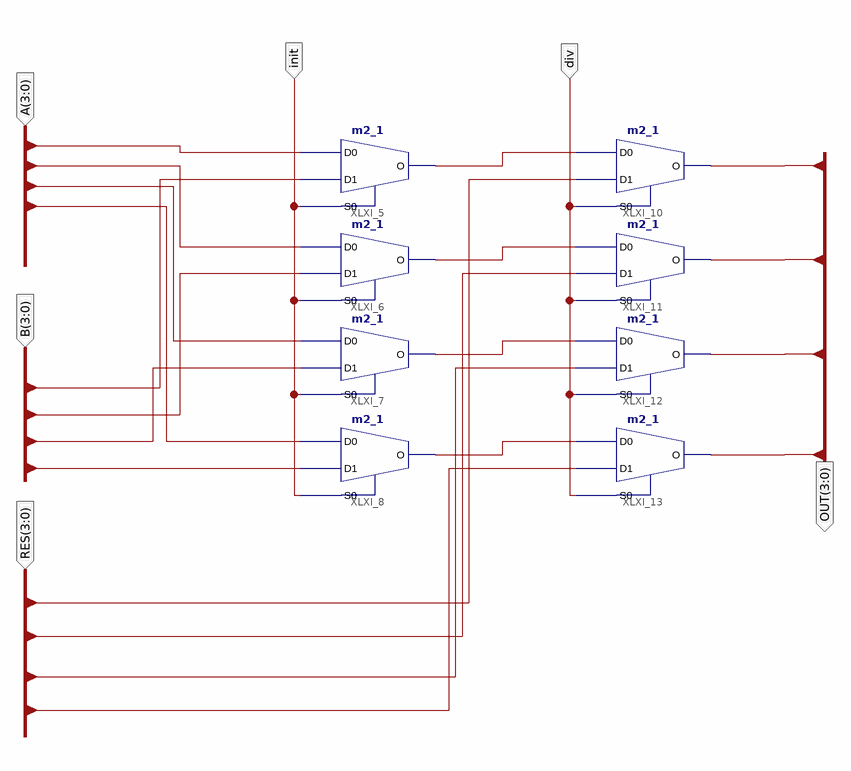
[diagram p0: schematic sheet 1]
// Xilinx ISE schematic mux.sch (spartan3) as structural Verilog: 8 symbols, 6 ports
module mux (
  input  [3:0] B,
  input  [3:0] RES,
  input  [3:0] A,
  input  init,
  input  div,
  output [3:0] OUT
);

  wire XLXN_1, XLXN_2, XLXN_3, XLXN_4, XLXN_13, XLXN_14, XLXN_15, XLXN_16, XLXN_17, XLXN_19, XLXN_20,
       XLXN_21, XLXN_22, XLXN_23, XLXN_24, XLXN_25, XLXN_27, XLXN_29, XLXN_30, XLXN_31;

  m2_1 XLXI_5 (.D0(XLXN_13), .D1(XLXN_17), .S0(init), .O(XLXN_1));
  m2_1 XLXI_6 (.D0(XLXN_14), .D1(XLXN_19), .S0(init), .O(XLXN_2));
  m2_1 XLXI_7 (.D0(XLXN_15), .D1(XLXN_20), .S0(init), .O(XLXN_3));
  m2_1 XLXI_8 (.D0(XLXN_16), .D1(XLXN_21), .S0(init), .O(XLXN_4));
  m2_1 XLXI_10 (.D0(XLXN_1), .D1(XLXN_22), .S0(div), .O(XLXN_27));
  m2_1 XLXI_11 (.D0(XLXN_2), .D1(XLXN_23), .S0(div), .O(XLXN_29));
  m2_1 XLXI_12 (.D0(XLXN_3), .D1(XLXN_24), .S0(div), .O(XLXN_30));
  m2_1 XLXI_13 (.D0(XLXN_4), .D1(XLXN_25), .S0(div), .O(XLXN_31));
endmodule
